# EAGLE design v21 (EAGLE 9.6.1)
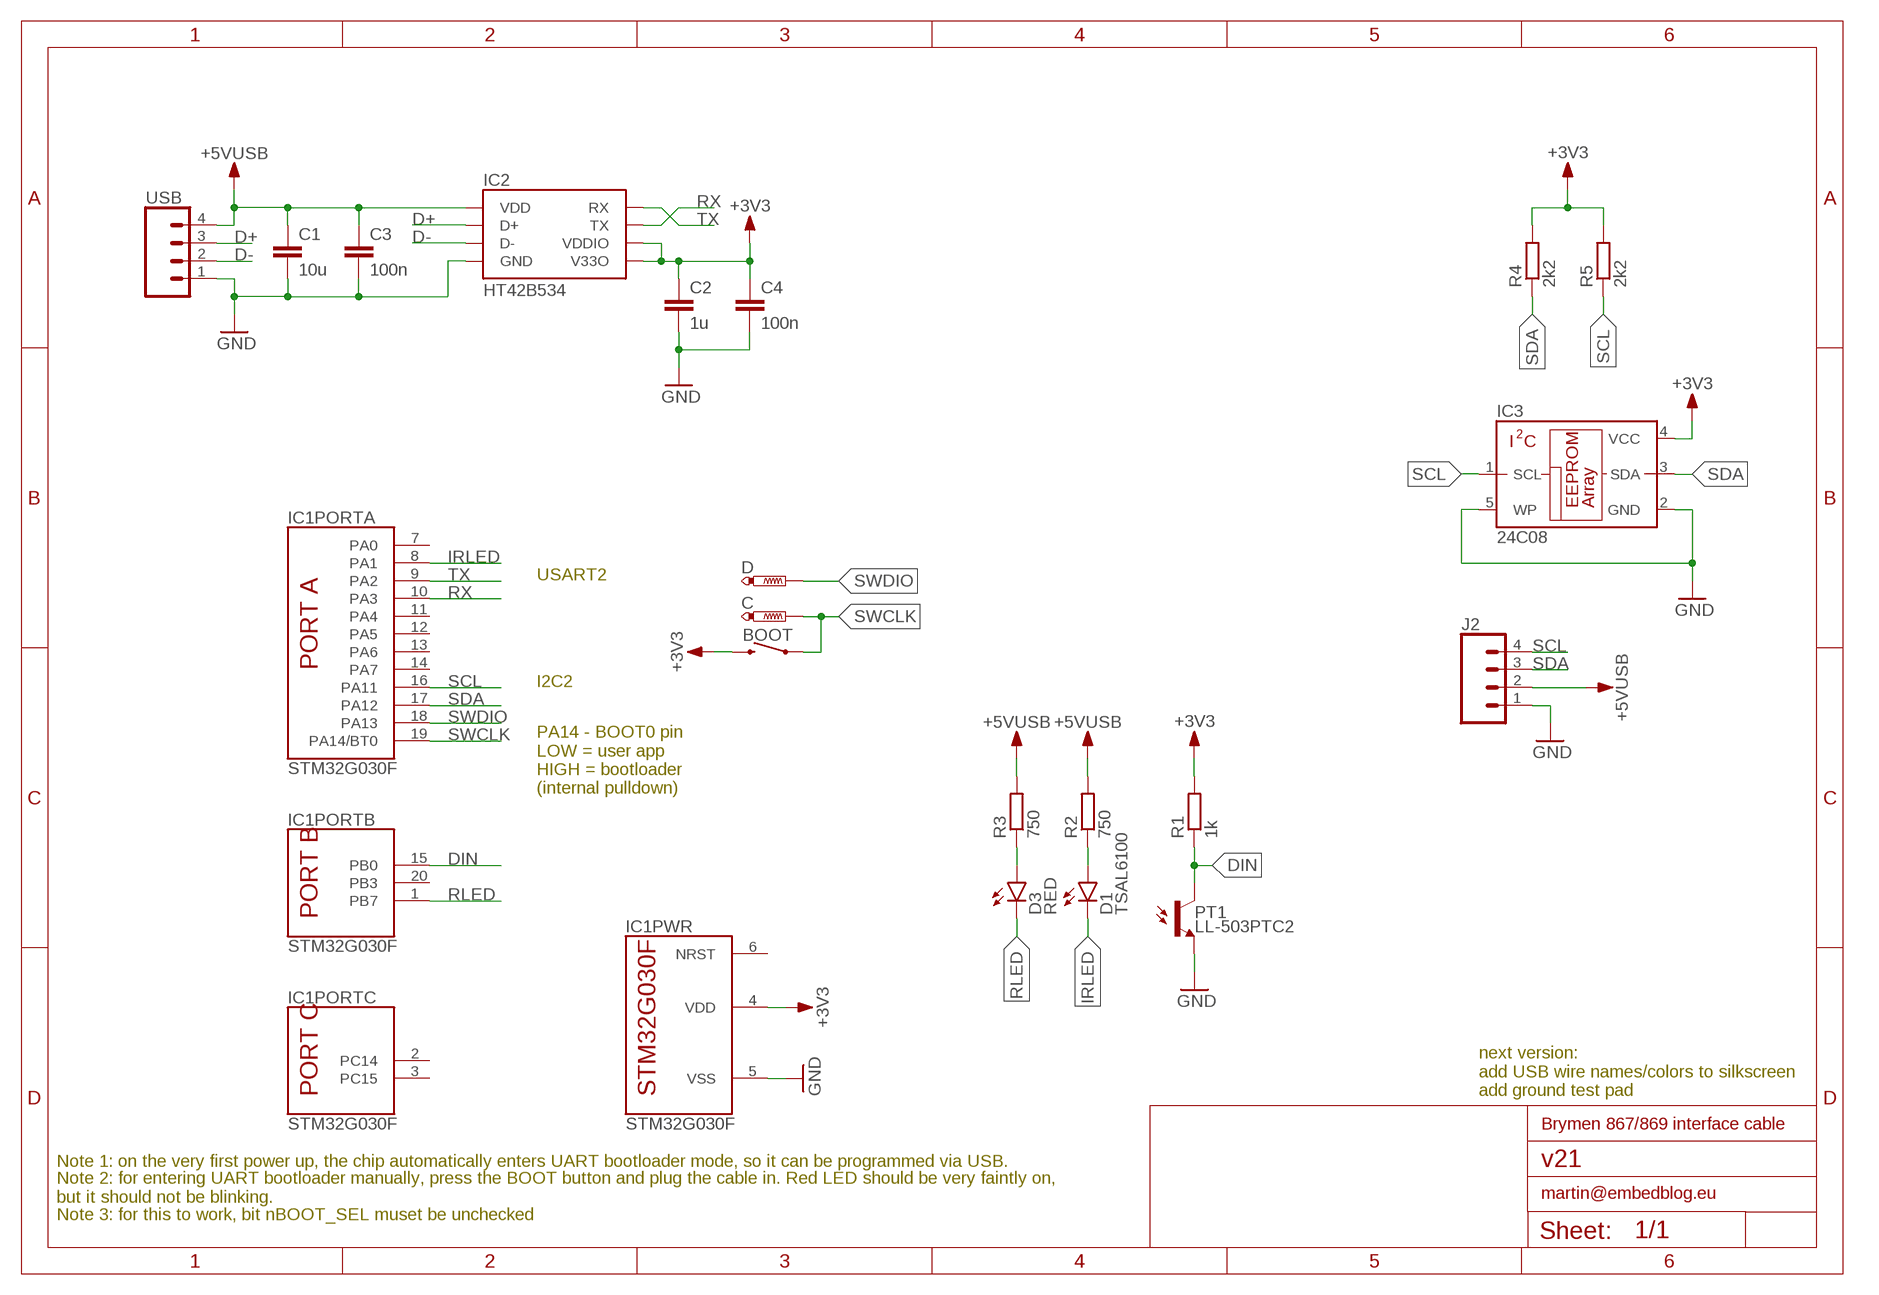
[diagram p0: schematic, sheet 1]

## Parts
BOOT  MOMENTARY-SWITCH-SPST-SMD-5.2MM  [TACTILE_SWITCH_SMD_5.2MM]
C  PTR1B1,27  [B1,27]
C1  10u  C0603  [C0603]
C2  1u  C0603  [C0603]
C3  100n  C0603  [C0603]
C4  100n  C0603  [C0603]
D  PTR1B1,27  [B1,27]
D1  TSAL6100  LED5MM  [LED_5MM]
D3  RED  LED0603  [LED-0603]
IC1  STM32G030F  [TSSOP20]
IC2  HT42B534  [SOP8]
IC3  24C08  EEPROM_24  [SOT23-5]
J2  CONN_041.27MM  [1X04_1.27MM]
PT1  LL-503PTC2  LL-503_PHOTOTRANSISTOR  [LED5MM]
R1  1k  R0603  [R0603]
R2  750  R0603  [R0603]
R3  750  R0603  [R0603]
R4  2k2  R0603  [R0603]
R5  2k2  R0603  [R0603]
USB  CONN_04  [1X04]

## Nets
+3V3: BOOT.3 C2.1 C4.1 IC1.4(PWR:VDD) IC2.3(VDDIO) IC2.8(V33O) IC3.4(VCC) R1.2 R4.2 R5.2
+5VUSB: C1.1 C3.1 IC2.7(VDD) J2.2 R2.2 R3.2 USB.4
D+: IC2.5(D+) USB.3
D-: IC2.6(D-) USB.2
DIN: IC1.15(PORTB:PB0) PT1.K(C) R1.1
GND: C1.2 C2.2 C3.2 C4.2 IC1.5(PWR:VSS) IC2.1(GND) IC3.2(GND) IC3.5(WP) J2.1 PT1.A(E) USB.1
IRLED: D1.K(C) IC1.8(PORTA:PA1)
N$3: D1.A R2.1
N$5: D3.A R3.1
RLED: D3.C IC1.1(PORTB:PB7)
RX: IC1.10(PORTA:PA3) IC2.2(TX)
SCL: IC1.16(PORTA:PA11) IC3.1(SCL) J2.4 R5.1
SDA: IC1.17(PORTA:PA12) IC3.3(SDA) J2.3 R4.1
SWCLK: BOOT.1 C.TP IC1.19(PORTA:PA14/BT0)
SWDIO: D.TP IC1.18(PORTA:PA13)
TX: IC1.9(PORTA:PA2) IC2.4(RX)
Unconnected: IC1.2(PORTC:PC14) IC1.3(PORTC:PC15) IC1.6(PWR:NRST) IC1.7(PORTA:PA0) IC1.11(PORTA:PA4) IC1.12(PORTA:PA5) IC1.13(PORTA:PA6) IC1.14(PORTA:PA7) IC1.20(PORTB:PB3)

## Notes on the sheet
- USART2
- I2C2
- PA14 - BOOT0 pin
  LOW = user app
  HIGH = bootloader
  (internal pulldown)
- next version:
  add USB wire names/colors to silkscreen
  add ground test pad
- Brymen 867/869 interface cable
- Note 1: on the very first power up, the chip automatically enters UART bootloader mode, so it can be programmed via USB.
- martin@embedblog.eu
- Note 2: for entering UART bootloader manually, press the BOOT button and plug the cable in. Red LED should be very faintly on, 
  but it should not be blinking.
- Note 3: for this to work, bit nBOOT_SEL muset be unchecked

## Library data of the parts
BOOT = SparkFun-Switches:MOMENTARY-SWITCH-SPST: Momentary Switch (Pushbutton) - SPST Normally-open (NO) SPST momentary switches (buttons, pushbuttons). Variants PTH-12MM - 12mm square, through-hole Momentary Pushbutton Switch - 12mm Square <https://www.sparkfun.com/products/9190> (COM-09190) PTH-6.0MM, PTH-6.0MM-KIT - 6.0mm square, through-hole Mini Pushbutton Switch <https://www.sparkfun.com/products/97> (COM-00097) KIT package intended for soldering kit's - only one side of pads' copper is exposed. PTH-RIGHT-ANGLE-KIT - Right-angle, through-hole Right Angle Tactile Button <https://www.sparkfun.com/products/10791> - Used on SparkFun BigTime Watch Kit <https://www.sparkfun.com/products/11734> SMD-12MM - 12mm square, surface-mount Tactile Button - SMD (12mm) <https://www.sparkfun.com/products/12993> (COM-12993) Used on SparkFun PicoBoard <https://www.sparkfun.com/products/11888> SMD-4.5MM - 4.5mm Square Trackball Switch Used on SparkFun Blackberry Trackballer Breakout <https://www.sparkfun.com/products/13169> SMD-4.6MMX2.8MM - 4.60mm x 2.80mm, surface mount Used on SparkFun SAMD21 Mini Breakout <https://www.sparkfun.com/products/13664> SMD-5.2MM, SMD-5.2-REDUNDANT - 5.2mm square, surface-mount Mini Pushbutton Switch - SMD <https://www.sparkfun.com/products/8720> (COM-08720) Used on Arduino Pro Mini <https://www.sparkfun.com/products/11114> REDUNDANT package connects both switch circuits together SMD-6.0X3.5MM - 6.0 x 3.5mm, surface mount Momentary Reset Switch SMD <https://www.sparkfun.com/products/8229> (COM-08229) SMD-6.2MM-TALL - 6.2mm square, surface mount Tactile Button - SMD (6mm) <https://www.sparkfun.com/products/12992> Used on SparkFun Digital Sandbox <https://www.sparkfun.com/products/12651> SMD-RIGHT-ANGLE - Right-angle, surface mount Used on SparkFun Block for Intel® Edison - Arduino <https://www.sparkfun.com/products/13036>; PROD_ID: SWCH-08247; SF_SKU: COM-08720
C D = testpad:PTR1: TEST PIN
C1-C4 = custom_passives:C
D1 = SparkFun-LED:LED: LED (Generic) Standard schematic elements and footprints for 5mm, 3mm, 1206, and 0603 sized LEDs. Generic LEDs with no color specified.
D3 = SparkFun-LED:LED: LED (Generic) Standard schematic elements and footprints for 5mm, 3mm, 1206, and 0603 sized LEDs. Generic LEDs with no color specified.; LCSC#: C2286
IC1 = custom_MCU:STM32G030F
IC2 = custom:HT42B534
IC3 = custom_IC:EEPROM_24
J2 = SparkFun-Connectors:CONN_04: Multi connection point. Often used as Generic Header-pin footprint for 0.1 inch spaced/style header connections On any of the 0.1 inch spaced packages, you can populate with these: Break Away Headers - Straight <https://www.sparkfun.com/products/116> (PRT-00116) Break Away Male Headers - Right Angle <https://www.sparkfun.com/products/553> (PRT-00553) Female Headers <https://www.sparkfun.com/products/115> (PRT-00115) Break Away Headers - Machine Pin <https://www.sparkfun.com/products/117> (PRT-00117) Break Away Female Headers - Swiss Machine Pin <https://www.sparkfun.com/products/743> (PRT-00743) For SCREWTERMINALS and SPRING TERMINALS visit here: Screw Terimnals on SparkFun.com <https://www.sparkfun.com/search/results?term=Screw+Terminals> (5mm/3.5mm/2.54mm spacing) This device is also useful as a general connection point to wire up your design to another part of your project. Our various solder wires solder well into these plated through hole pads. Hook-Up Wire - Assortment (Stranded, 22 AWG) <https://www.sparkfun.com/products/11375> (PRT-11375) Hook-Up Wire - Assortment (Solid Core, 22 AWG) <https://www.sparkfun.com/products/11367> (PRT-11367) View the entire wire category on our website here <https://www.sparkfun.com/categories/141> Special notes: Molex polarized connector foot print use with SKU : PRT-08231 with associated crimp pins and housings. 1MM SMD Version SKU: PRT-10208
PT1 = custom:LL-503_PHOTOTRANSISTOR
R1-R5 = custom_passives:R
USB = SparkFun-Connectors:CONN_04: Multi connection point. Often used as Generic Header-pin footprint for 0.1 inch spaced/style header connections On any of the 0.1 inch spaced packages, you can populate with these: Break Away Headers - Straight <https://www.sparkfun.com/products/116> (PRT-00116) Break Away Male Headers - Right Angle <https://www.sparkfun.com/products/553> (PRT-00553) Female Headers <https://www.sparkfun.com/products/115> (PRT-00115) Break Away Headers - Machine Pin <https://www.sparkfun.com/products/117> (PRT-00117) Break Away Female Headers - Swiss Machine Pin <https://www.sparkfun.com/products/743> (PRT-00743) For SCREWTERMINALS and SPRING TERMINALS visit here: Screw Terimnals on SparkFun.com <https://www.sparkfun.com/search/results?term=Screw+Terminals> (5mm/3.5mm/2.54mm spacing) This device is also useful as a general connection point to wire up your design to another part of your project. Our various solder wires solder well into these plated through hole pads. Hook-Up Wire - Assortment (Stranded, 22 AWG) <https://www.sparkfun.com/products/11375> (PRT-11375) Hook-Up Wire - Assortment (Solid Core, 22 AWG) <https://www.sparkfun.com/products/11367> (PRT-11367) View the entire wire category on our website here <https://www.sparkfun.com/categories/141> Special notes: Molex polarized connector foot print use with SKU : PRT-08231 with associated crimp pins and housings. 1MM SMD Version SKU: PRT-10208; PROD_ID: CONN-09696

## Board
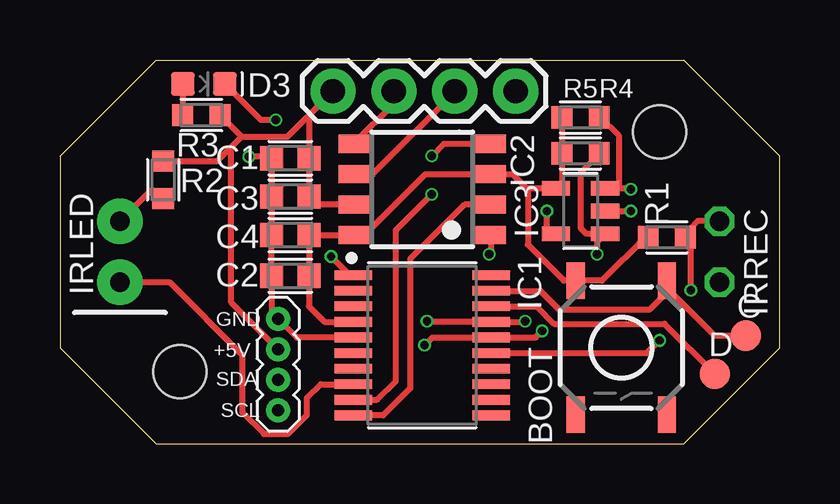
[diagram p1: board, top side]
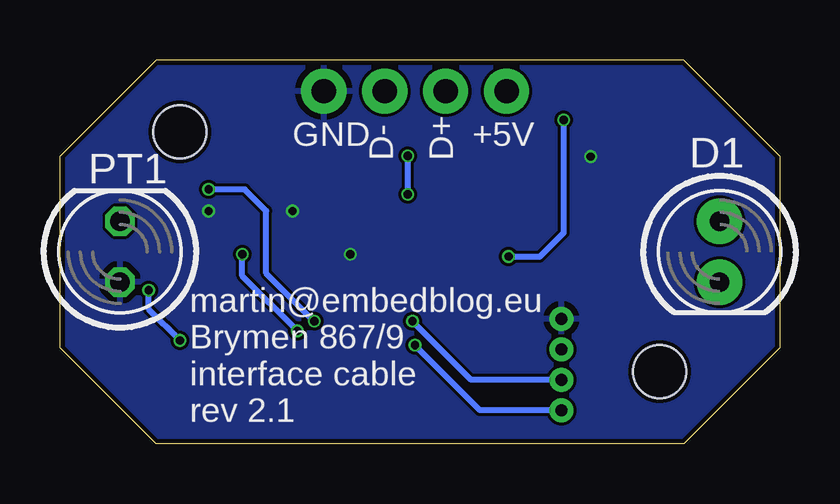
[diagram p2: board, bottom side, seen from below]

Size 30 x 16 mm. Coordinates in mm from the lower left corner, seen from the top.
Outline: 0,12 4,16 26,16 30,12 30,4 26,0 4,0 0,4 0,12
Copper layers (1*16): Top 0.035mm / dielectric 1.2mm / Bottom 0.035mm
Design rules "JLCPCB": minimum track width 5mil, minimum drill 0.3mm, track to track 5mil, track to pad 5mil, pad to pad 5mil, via to via 5mil, smd to smd 5mil, copper to edge 0.2mm, drill to drill 6mil, minimum pad ring 3mil, minimum via ring 3mil, stop-mask expansion 4mil, vias tented up to drill 0mil, thermal gap 10mil
Holes 2.2 mm at 5,3 25,13

### Footprints (pad centres in the part's own frame; a part is rotated, then mirrored left to right if it is on the bottom)
TACTILE_SWITCH_SMD_5.2MM = smd 1.524 x 0.762: 1 -2.794,1.905; 2 2.794,1.905; 3 -2.794,-1.905; 4 2.794,-1.905
B1,27 = smd 1.27 x 1.27: TP 0,0
C0603 = smd 0.959 x 1.015: 1 -0.778,0; 2 0.778,0
LED_5MM = drill 0.813 pad 1.88: A -1.27,0; K 1.27,0
LED-0603 = smd 1 x 1: A -0.877,0; C 0.877,0
TSSOP20 = smd 1.559 x 0.407: 1 -2.878,2.925; 2 -2.878,2.275; 3 -2.878,1.625; 4 -2.878,0.975; 5 -2.878,0.325; 6 -2.878,-0.325; 7 -2.878,-0.975; 8 -2.878,-1.625; 9 -2.878,-2.275; 10 -2.878,-2.925; 11 2.878,-2.925; 12 2.878,-2.275; 13 2.878,-1.625; 14 2.878,-0.975; 15 2.878,-0.325; 16 2.878,0.325; 17 2.878,0.975; 18 2.878,1.625; 19 2.878,2.275; 20 2.878,2.925
SOP8 = smd 0.76 x 1.27: 1 -1.905,-2.86; 2 -0.635,-2.86; 3 0.635,-2.86; 4 1.905,-2.86; 5 1.905,2.86; 6 0.635,2.86; 7 -0.635,2.86; 8 -1.905,2.86
SOT23-5 = smd 1.18 x 0.609: 1 -1.024,0.95; 2 -1.024,0; 3 -1.024,-0.95; 4 1.024,-0.95; 5 1.024,0.95
1X04_1.27MM = drill 0.508 pad 1: 1 0,0; 2 1.27,0; 3 2.54,0; 4 3.81,0
LED5MM = drill 0.813 octagon: A -1.27,0; K 1.27,0
R0603 = smd 0.87 x 0.929: 1 -0.78,0; 2 0.78,0
1X04 = drill 1.016 pad 1.88: 1 0,0; 2 2.54,0; 3 5.08,0; 4 7.62,0

### Placement (x,y rotation side)
BOOT  23.4,4 270 top
C  28.6,4.5 0 top
C1  9.6,11.9 180 top
C2  9.6,7 180 top
C3  9.6,10.3 180 top
C4  9.6,8.7 180 top
D  27.3,2.9 0 top
D1  2.5,8 270 bottom
D3  6,15 0 top
IC1  15.1,4.1 0 top
IC2  15.1,10.6 90 top
IC3  21.7,9.7 180 top
J2  9.1,5.2 270 top
PT1  27.5,8 90 bottom
R1  25.3,8.6 180 top
R2  4.3,11 90 top
R3  5.9,13.7 0 top
R4  21.7,13.6 180 top
R5  21.7,12.1 180 top
USB  19,14.7 180 top

### Tracks (layer width: path | path; a pad name or v marks a point on that pad's centre or on a via)
+3V3
  Top 0.254: R4.2 R5.2 20.92,10.89 IC3.4 19.45,10.65 | IC1.4 11.03,5.08 10.38,5.72 C2.1 C4.1 IC2.8 12.7,8.7 15.23,11.23 IC2.3 18.86,11.23 19.45,10.65 | R1.2 24.4,8.6 22.59,6.79 BOOT.3 21.01,6.79 19.5,8.3 19.5,10.6 19.45,10.65
+5VUSB
  Top 0.254: USB.4 10.38,13.7 | 10.38,13.7 C1.1 C3.1 10.71,9.96 IC2.7 | R3.2 7.58,12.8 | 10.38,13.7 9.48,12.8 7.58,12.8 | R2.2 6.56,11.78 7.14,12.36 | 7.14,12.36 7.58,12.8 | 7.14,12.36 7.14,5.89 J2.2
D+
  Top 0.254: IC2.5 13.92,14.19 USB.3
D-
  Top 0.254: IC2.6 13.04,11.23 16.46,14.66 USB.2
DIN  (via drill 0.35)
  Top 0.254: PT1.K 27.47,9.3 26.6,9.3 26.3,9 26.3,8.82 R1.1 26.3,8.6 v26.3,6.4 | IC1.15 24.48,3.77 v25,4.3
  Bottom 0.254: v25,4.3 26.3,5.6 v26.3,6.4
GND  (via drill 0.35)
  Top 0.254: IC3.2 v23.8,9.7 | IC3.5 20.3,8.76 v20.3,9.7 | IC1.5 9.88,4.42 J2.1 8.82,5.48 C2.2 C4.2 C3.2 C1.2 8.75,11.97 v7.87,11.97 | IC2.1 17.96,7.96 v17.9,7.9
  pour Bottom: 0,12 4,16 26,16 30,12 30,4 26,0 4,0 0,4
IRLED
  Top 0.254: D1.K 4.57,6.73 7.6,3.7 7.6,1.3 8.5,0.4 9.5,0.4 10.3,1.2 10.3,1.9 10.88,2.48 IC1.8
N$3
  Top 0.254: D1.A 3.77,10.54 R2.1
N$5
  Top 0.254: D3.A 5.12,14.02 R3.1
RLED  (via drill 0.35)
  Top 0.254: v9,13.5 8.38,13.5 D3.C | v11.3,7.8 12.07,7.03 IC1.1
  Bottom 0.254: v11.3,7.8 10,7.8 9,8.8 v9,13.5
RX
  Top 0.254: IC1.10 13.47,1.18 14.6,2.3 14.6,7.7 16.86,9.96 IC2.2
SCL  (via drill 0.35)
  Top 0.254: v20.1,4.7 19.82,4.42 IC1.16 15.53,4.42 v15.2,4.1 | v22.4,7.9 22.4,8.43 IC3.1 21.95,8.75 21.7,9 21.7,11.3 22.48,12.08 R5.1
  Bottom 0.254: v20.1,4.7 22.4,7 v22.4,7.9 | J2.4 12.49,1.39 v15.2,4.1
SDA  (via drill 0.35)
  Top 0.254: R4.1 22.56,13.6 23.3,12.86 23.3,10.65 | IC1.17 18.1,5.08 | 18.1,5.08 19.38,5.08 v19.4,5.1 | v15.3,5.1 18.07,5.1 18.1,5.08 | v23.8,10.6 23.75,10.65 23.3,10.65 | IC3.3 23.3,10.65
  Bottom 0.254: v19.4,5.1 21.4,7.1 21.4,9.7 22.3,10.6 v23.8,10.6 | J2.3 12.86,2.66 v15.3,5.1
SWCLK
  Top 0.254: IC1.19 20.02,6.38 20.8,5.6 24.6,5.6 25.3,6.3 25.3,6.5 | C.TP 27.3,4.5 25.3,6.5 | BOOT.1 25.3,6.5
SWDIO
  Top 0.254: IC1.18 19.88,5.72 20.6,5 25.2,5 D.TP
TX  (via drill 0.35)
  Top 0.254: IC1.9 13.22,1.82 14,2.6 14,8.9 v15.5,10.4 | v15.5,12 16,12.51 IC2.4
  Bottom 0.254: v15.5,10.4 v15.5,12

### Text on the board
tPlace: GND | +5V | SDA | SCL
bPlace: martin@embedblog.eu / Brymen 867/9 / interface cable / rev 2.1
tNames: IRREC | IRLED
bNames: +5V | D+ | D- | GND
tDocu: GREEN | WHITE